# Altium schematic sheet power.SchDoc
size A3; DocumentNumber: 5; SheetNumber: 5; SheetTotal: 24; SheetDescription: Decoupling and references for MCU0
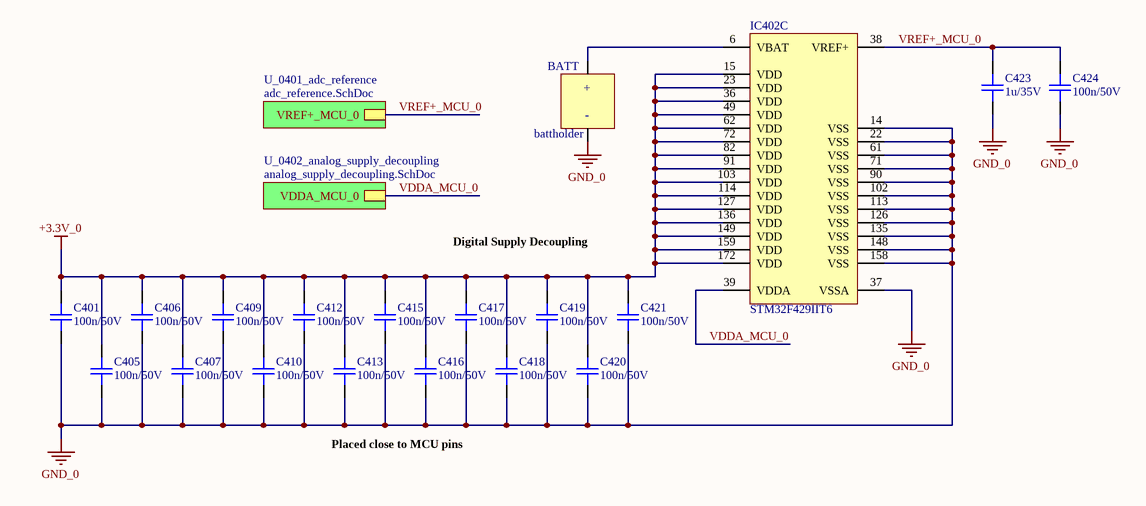
[diagram p0: power.SchDoc]

## Parts
BATT  battholder  [SMTU_1225-1-LF]
C401  100n/50V  [CAPC1608X08N]
C405  100n/50V  [CAPC1608X08N]
C406  100n/50V  [CAPC1608X08N]
C407  100n/50V  [CAPC1608X08N]
C409  100n/50V  [CAPC1608X08N]
C410  100n/50V  [CAPC1608X08N]
C412  100n/50V  [CAPC1608X08N]
C413  100n/50V  [CAPC1608X08N]
C415  100n/50V  [CAPC1608X08N]
C416  100n/50V  [CAPC1608X08N]
C417  100n/50V  [CAPC1608X08N]
C418  100n/50V  [CAPC1608X08N]
C419  100n/50V  [CAPC1608X08N]
C420  100n/50V  [CAPC1608X08N]
C421  100n/50V  [CAPC1608X08N]
C423  1u/35V  [CAPC1608X08N]
C424  100n/50V  [CAPC1608X08N]
IC402  STM32F429IIT6  [STM-LQFP176_N]  (part C of 3)

## Sub-sheets
U_0401_adc_reference = adc_reference.SchDoc: VREF+_MCU_0
U_0402_analog_supply_decoupling = analog_supply_decoupling.SchDoc: VDDA_MCU_0

## Nets
+3.3V_0: C401.1 C405.1 C406.1 C407.1 C409.1 C410.1 C412.1 C413.1 C415.1 C416.1 C417.1 C418.1 C419.1 C420.1 C421.1 IC402.15(VDD) IC402.23(VDD) IC402.36(VDD) IC402.49(VDD) IC402.62(VDD) IC402.72(VDD) IC402.82(VDD) IC402.91(VDD) IC402.103(VDD) IC402.114(VDD) IC402.127(VDD) IC402.136(VDD) IC402.149(VDD) IC402.159(VDD) IC402.172(VDD)
GND_0: BATT.- C401.2 C405.2 C406.2 C407.2 C409.2 C410.2 C412.2 C413.2 C415.2 C416.2 C417.2 C418.2 C419.2 C420.2 C421.2 C423.2 C424.2 IC402.14(VSS) IC402.22(VSS) IC402.37(VSSA) IC402.61(VSS) IC402.71(VSS) IC402.90(VSS) IC402.102(VSS) IC402.113(VSS) IC402.126(VSS) IC402.135(VSS) IC402.148(VSS) IC402.158(VSS)
VDDA_MCU_0: IC402.39(VDDA) ; sheet U_0402_analog_supply_decoupling/VDDA_MCU_0
VREF+_MCU_0: C423.1 C424.1 IC402.38(VREF+) ; sheet U_0401_adc_reference/VREF+_MCU_0
NetBATT_+: BATT.+ IC402.6(VBAT)

## Notes on the sheet
- Digital Supply Decoupling
- Placed close to MCU pins
- Fraunhofer IISB
- Schottkystr. 10
- developed by:
- 91058 Erlangen
- Germany
- Author
- Project
- License
- Description
- File
- Version
- Release Date
- Sheet
- www.foxbms.org
- www.iisb.fraunhofer.de
- foxBMS Team
- /

## Library data of the parts
BATT = Batt_Holder_SMTU_1225-1-LF: SMTU 1225-1-LF, Battery Holder 1225; Manufacturer: Renata; Automotive Qualified: False; Part Number: Batt_Holder_SMTU_1225-1-LF; Operating Temperature: - / -40°C - +100°C; ComponentLink1Description: Datasheet; ComponentLink1URL: http://www.farnell.com/datasheets/1766152.pdf; Supplier 1: Farnell; Supplier Part Number 1: 1216353
C401 C405-C407 C409 C410 C412 C413 C415-C421 C424 = gen_C_ceramic_100n_50V_X7R_0603: MLCC; Capacitance: 100n; Rated Voltage: 50V; Dielectric: X7R; Case EIA: 0603; Case Metric: 1608; PnP Package: C_0603_10; PnP Value: 100n/50V/X7R; PnP equipped: x; Automotive Qualified: False; Part Number: gen_C_ceramic_100n_50V_X7R_0603; Supplier 1: Farnell; Supplier Part Number 1: 2525267; Supplier 2: Digikey; Supplier Part Number 2: 490-6049-1-ND
C423 = gen_C_ceramic_1u_35V_X7R_0603: MLCC; Capacitance: 1u; Rated Voltage: 35V; Dielectric: X7R; Case EIA: 0603; Case Metric: 1608; PnP Package: C_0603_10; PnP Value: 1uF/35V/X7R; PnP equipped: x; Automotive Qualified: False; Part Number: gen_C_ceramic_1u_35V_X7R_0603; Supplier 1: Farnell; Supplier Part Number 1: 1907508
IC402 = CMP-0243-00078-2: ARM Cortex-M4 32-bit MCU+FPU, 225 DMIPS, 2048 kB Flash, 256 kB Internal RAM, 140 I/Os, 176-pin LQFP, -40 to 85 degC, Tray; Manufacturer: STMicroelectronics; Internal RAM Size (kB): 256; I/Os (High Current): 140; FLASH Size (Prog) (kB): 2048; D/A Converter: 2x12-bit; Supply Voltage(Vcc) max (V): 3.6; Operating Frequency(F) (Processor speed) (MHz): 180; Supply Voltage(Vcc) min (V): 1.8; Core: ARM Cortex-M4; PackageReference: LQFP176; ComponentLink1Description: Manufacturer URL; Packing: Tray; ComponentLink2Description: Datasheet; ComponentLink3Description: Package Specification; ComponentLink2URL: http://www.st.com/st-web-ui/static/active/en/resource/technical/document/data_brief/DM00053488.pdf; PackageVersion: Rev. 4, 06/2013; ComponentLink1URL: http://www.st.com/web/en/home.html; DatasheetVersion: Rev. 2; PartNumber: STM32F429IIT6; PackageDescription: 176-Pin Low Profile Quad Flat Package, 24 x 24 mm Body, 0.5 mm Pitch; ComponentLink3URL: http://www.st.com/st-web-ui/static/active/en/resource/technical/document/datasheet/DM00035129.pdf; Mounting Technology: Surface Mount